# Altium schematic sheet EOG_FRONT_END.SchDoc
size A4; SheetNumber: 1; SheetTotal: 4
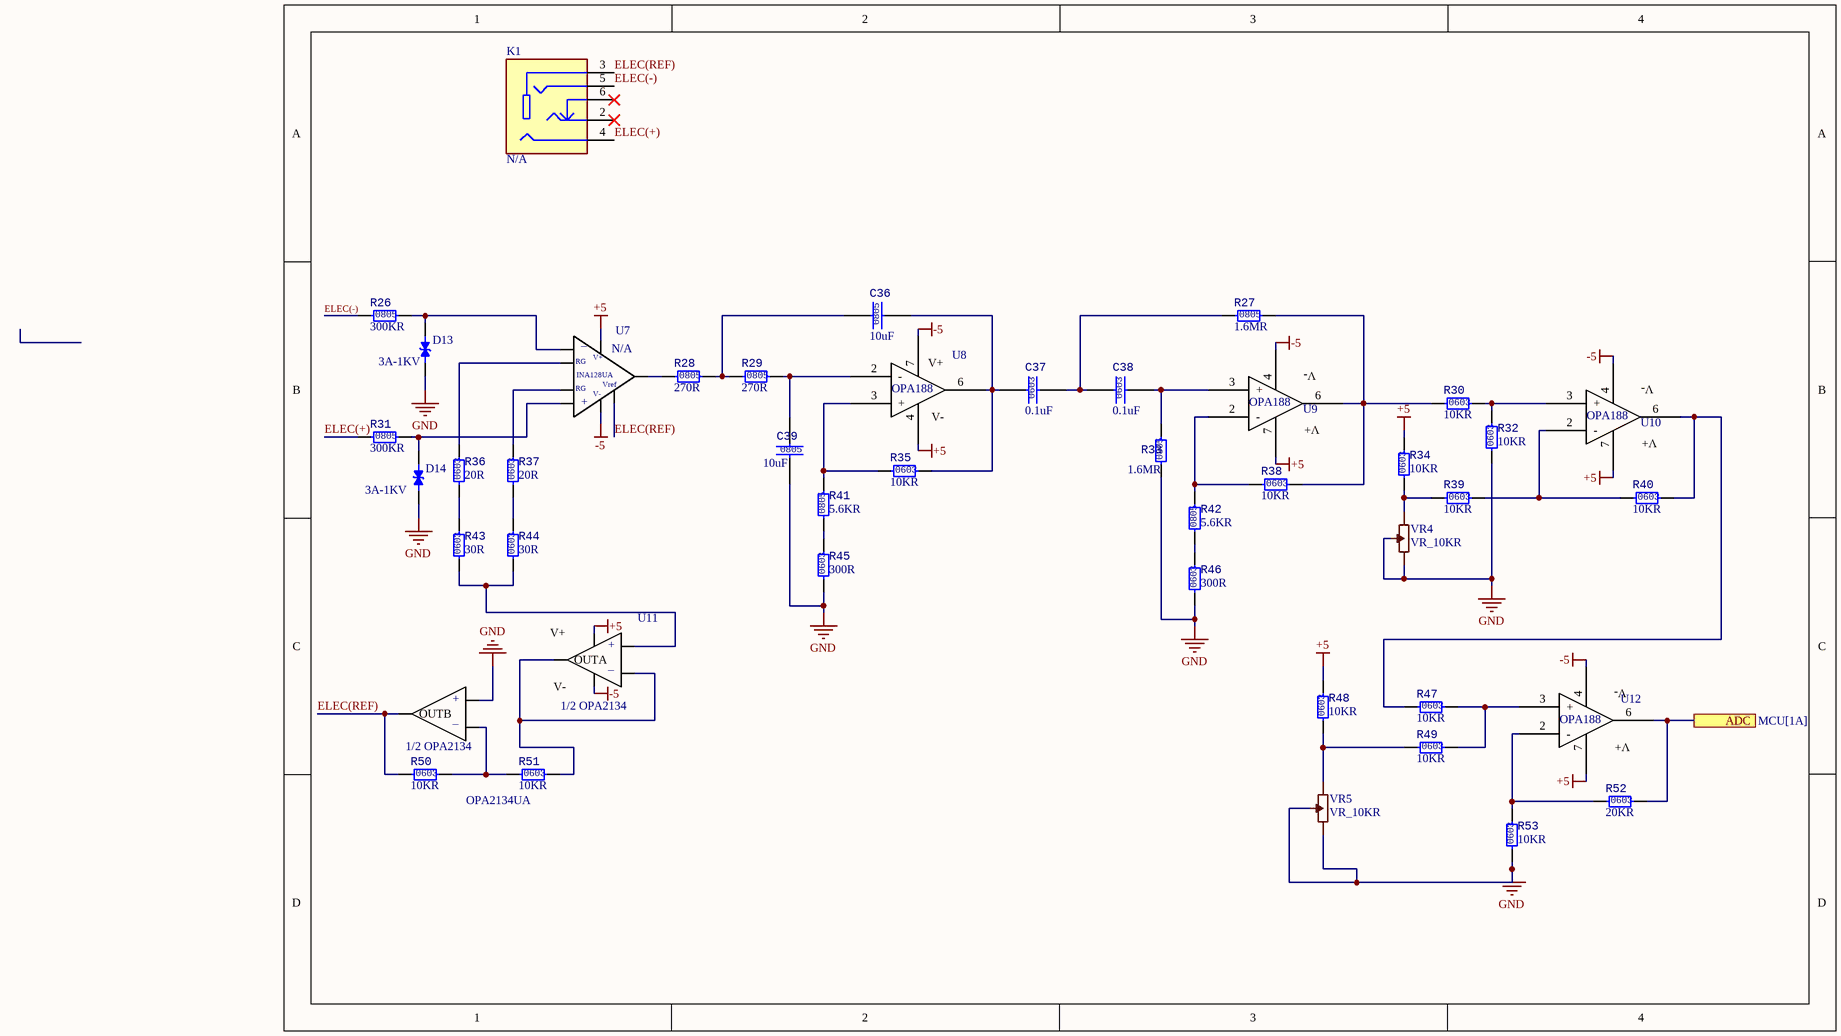
[diagram p0: EOG_FRONT_END.SchDoc]

## Parts
C36  Size: 0805  [CAPCER 0603 SMD]  (hidden comment: 10uF)
C37  Size: 0603  [CAPCER 0805 SMD]  (hidden comment: 0.1uF)
C38  Size: 0603  [CAPCER 0805 SMD]  (hidden comment: 0.1uF)
C39  Size: 0805  [CAPCER 0603 SMD]  (hidden comment: 10uF)
D13  value 3A-1KV  [DO-214AC]  (hidden comment: SMAJ5.0)
D14  value 3A-1KV  [DO-214AC]  (hidden comment: SMAJ5.0)
K1  JACK_3.5_5P  [PJ-327A]  (value not drawn)
R26  Size: 0805  [RESC 0805 SMD]  (hidden comment: 300KR)
R27  Size: 0805  [RESC 0805 SMD]  (hidden comment: 1.6MR)
R28  Size: 0805  [RESC 0805 SMD]  (hidden comment: 270R)
R29  Size: 0805  [RESC 0805 SMD]  (hidden comment: 270R)
R30  Size: 0603  [RESC 0603(1608) SMD]  (hidden comment: 10KR)
R31  Size: 0805  [RESC 0805 SMD]  (hidden comment: 300KR)
R32  Size: 0603  [RESC 0603(1608) SMD]  (hidden comment: 10KR)
R33  Size: 0805  [RESC 0805 SMD]  (hidden comment: 1.6MR)
R34  Size: 0603  [RESC 0603(1608) SMD]  (hidden comment: 10KR)
R35  Size: 0603  [RESC 0603(1608) SMD]  (hidden comment: 10KR)
R36  value 20R  Size: 0603  [RESC 0603(1608) SMD]  (hidden comment: 510R)
R37  value 20R  Size: 0603  [RESC 0603(1608) SMD]  (hidden comment: 510R)
R38  Size: 0603  [RESC 0603(1608) SMD]  (hidden comment: 10KR)
R39  Size: 0603  [RESC 0603(1608) SMD]  (hidden comment: 10KR)
R40  Size: 0603  [RESC 0603(1608) SMD]  (hidden comment: 10KR)
R41  Size: 0805  [RESC 0805 SMD]  (hidden comment: 5.6KR)
R42  Size: 0805  [RESC 0805 SMD]  (hidden comment: 5.6KR)
R43  value 30R  Size: 0603  [RESC 0603(1608) SMD]  (hidden comment: 12KR)
R44  value 30R  Size: 0603  [RESC 0603(1608) SMD]  (hidden comment: 12KR)
R45  Size: 0603  [RESC 0603(1608) SMD]  (hidden comment: 300R)
R46  Size: 0603  [RESC 0603(1608) SMD]  (hidden comment: 300R)
R47  Size: 0603  [RESC 0603(1608) SMD]  (hidden comment: 10KR)
R48  Size: 0603  [RESC 0603(1608) SMD]  (hidden comment: 10KR)
R49  Size: 0603  [RESC 0603(1608) SMD]  (hidden comment: 10KR)
R50  Size: 0603  [RESC 0603(1608) SMD]  (hidden comment: 10KR)
R51  Size: 0603  [RESC 0603(1608) SMD]  (hidden comment: 10KR)
R52  value 20KR  Size: 0603  [RESC 0603(1608) SMD]  (hidden comment: 10KR)
R53  Size: 0603  [RESC 0603(1608) SMD]  (hidden comment: 10KR)
U7  INA128UA  [8-SOIC]  (value not drawn)
U8  value OPA188  [8-SOIC-OPA]  (hidden comment: OPA188AID)
U9  value OPA188  [8-SOIC-OPA]  (hidden comment: OPA188AID)
U10  value OPA188  [8-SOIC-OPA]  (hidden comment: OPA188AID)
U11  OPA2134UA  [8-SOIC-OPA]
U12  value OPA188  [8-SOIC-OPA]  (hidden comment: OPA188AID)
VR4  VR_10KR  [EVM3E]
VR5  VR_10KR  [EVM3E]

## Ports
ADC (see MCU[1A])

## Nets
+5: R34.2 R48.2 U7.7 U8.4(GND) U9.7(VCC) U10.7(VCC) U11.8(V+) U12.7(VCC)
-5: U7.4 U8.7(VCC) U9.4(GND) U10.4(GND) U11.4(V-) U12.4(GND)
GND: C39.2 D13.1 D14.1 R32.1 R33.1 R45.1 R46.1 R53.1 U11.5(INB(+)) VR4.1 VR4.2 VR5.1 VR5.2
ADC: R52.2 U12.6(OUT_1) ; port ADC
ELEC(+): K1.4 R31.1
ELEC(-): K1.5 R26.1
ELEC(REF): K1.3 R50.1 U7.5 U11.7(OUTB)
NetC36_1: C36.1 R28.2 R29.1
NetC36_2: C36.2 C37.1 R35.2 U8.6(OUT_1)
NetC37_2: C37.2 C38.1 R27.1
NetC38_2: C38.2 R33.2 U9.3(+)
NetC39_1: C39.1 R29.2 U8.2(-)
NetD13_2: D13.2 R26.2 U7.2
NetD14_2: D14.2 R31.2 U7.3
NetR27_2: R27.2 R30.1 R38.2 U9.6(OUT_1)
NetR28_1: R28.1 U7.6
NetR30_2: R30.2 R32.2 U10.3(+)
NetR34_1: R34.1 R39.1 VR4.3
NetR35_1: R35.1 R41.2 U8.3(+)
NetR36_1: R36.1 R43.2
NetR36_2: R36.2 U7.1
NetR37_1: R37.1 R44.2
NetR37_2: R37.2 U7.8
NetR38_1: R38.1 R42.2 U9.2(-)
NetR39_2: R39.2 R40.1 U10.2(-)
NetR40_2: R40.2 R47.1 U10.6(OUT_1)
NetR41_1: R41.1 R45.2
NetR42_1: R42.1 R46.2
NetR43_1: R43.1 R44.1 U11.2(INA(+))
NetR47_2: R47.2 R49.2 U12.3(+)
NetR48_1: R48.1 R49.1 VR5.3
NetR50_2: R50.2 R51.1 U11.6(INB(-))
NetR51_2: R51.2 U11.1(OUTA) U11.3(INA(-))
NetR52_1: R52.1 R53.2 U12.2(-)

Not connected (* = marked no-connect by the designer): K1 2* 6(3)*

## Notes on the sheet
- (in symbol DB-0014) V-; V+
- (in symbol DB-0015) _; V+; RG; Vref; V-; +
- (in symbol DB-0029) +; _; 1/2 OPA2134

## Library data of the parts
C36 C39 = DB-0018: CAPACITOR SMD 10uF 25V 10% 0805; Design Item ID: DB-0018; Value: 10uF; Type: CAPACITOR; Power Rate: N/A; Tolerance: 10%; Footprint Type: SMD; Supplier: THEGIOIIC; Supplier Part Number: Tụ Gốm 0805 10uF 25V; Supplier Link: https://www.thegioiic.com/tu-gom-0805-10uf-25v
C37 C38 = DB-0017: CAPACITOR SMD 0.1uF 50V 10% 0603; Design Item ID: DB-0017; Value: 0.1uF; Type: CAPACITOR; Power Rate: N/A; Tolerance: 10%; Footprint Type: SMD; Supplier: THEGIOIIC; Supplier Part Number: Tụ Gốm 0603 100nF (0.1uF) 25V; Supplier Link: https://www.thegioiic.com/tu-gom-0603-100nf-0-1uf-25v
D13 D14 = DB-0021: TVS DIODE 5VWM 9.2VC SMA; Design Item ID: DB-0021; Type: DIODE; Power Rate: N/A; Tolerance: N/A; Footprint Type: SMD; Size: SMA; Supplier: DIGIKEY; Supplier Part Number: TVS DIODE 5VWM 9.2VC SMA; Supplier Link: https://www.digikey.com/en/products/detail/diodes-incorporated/smaj5-0a-13/278666
K1 = DB-0060: PJ-327A Cổng Audio 3.5mm 3 Cực 5 Chân Dán SMD; Value: N/A; Design Item ID: DB-0060; Type: N/A; Power Rate: N/A; Tolerance: N/A; Footprint Type: SMD; Size: PJ-327A; Supplier: THEGIOIIC; Supplier Part Number: PJ-327A Cổng Audio 3.5mm 3 Cực 5 Chân Dán SMD; Supplier Link: https://www.thegioiic.com/pj-327a-cong-audio-3-5mm-3-cuc-5-chan-dan-smd
R26 R31 = DB-0016: RESISTOR SMD 300KR OHM 5% 125mW 0805; Power Rate: 125mW; Design Item ID: DB-0016; Value: 300KR; Type: RESISTOR; Tolerance: 5%; Footprint Type: SMD; Supplier: THEGIOIIC; Supplier Part Number: Điện Trở 300 KOhm 0805 5%; Supplier Link: https://www.thegioiic.com/dien-tro-300-kohm-0805-5-
R27 R33 = DB-0025: RESISTOR SMD 1.6MR OHM 5% 125mW 0805; Power Rate: 125mW; Design Item ID: DB-0025; Value: 1.6MR; Type: RESISTOR; Tolerance: 5%; Footprint Type: SMD; Supplier: THEGIOIIC; Supplier Part Number: Điện Trở 1.6 KOhm 0805 5%; Supplier Link: https://www.thegioiic.com/dien-tro-1-6-kohm-0805-5-
R28 R29 = DB-0022: RESISTOR SMD 270R OHM 5% 125mW 0805; Power Rate: 125mW; Design Item ID: DB-0022; Value: 270R; Type: RESISTOR; Tolerance: 5%; Footprint Type: SMD; Supplier: THEGIOIIC; Supplier Part Number: Điện Trở 270 Ohm 0805 5%; Supplier Link: https://www.thegioiic.com/dien-tro-270-ohm-0805-5-
R30 R32 R34 R35 R38-R40 R47-R53 = DB-0003: RESISTOR SMD 10KR OHM 1% 100mW 0603; Power Rate: 100mW; Design Item ID: DB-0003; Type: RESISTOR; Tolerance: 1%; Footprint Type: SMD; Supplier: THEGIOIIC; Supplier Part Number: Điện Trở 10 KOhm 0603 1%; Supplier Link: https://www.thegioiic.com/dien-tro-10-kohm-0603-1-
  R30 R32 R34 R35 R38-R40 R47-R51 R53: Value: 10KR
R36 R37 = DB-0028: RESISTOR SMD 510R OHM 1% 100mW 0603; Power Rate: 100mW; Design Item ID: DB-0028; Type: RESISTOR; Tolerance: 1%; Footprint Type: SMD; Supplier: THEGIOIIC; Supplier Part Number: Điện Trở 510 Ohm 0603 1%; Supplier Link: https://www.thegioiic.com/dien-tro-510-ohm-0603-1-
R41 R42 = DB-0023: RESISTOR SMD 5.6KR OHM 1% 125mW 0805; Power Rate: 125mW; Design Item ID: DB-0023; Value: 5.6KR; Type: RESISTOR; Tolerance: 1%; Footprint Type: SMD; Supplier: THEGIOIIC; Supplier Part Number: Điện Trở 5.6 KOhm 0805 1%; Supplier Link: https://www.thegioiic.com/dien-tro-5-6-kohm-0805-1-
R43 R44 = DB-0027: RESISTOR SMD 12KR OHM 1% 100mW 0603; Power Rate: 100mW; Design Item ID: DB-0027; Type: RESISTOR; Tolerance: 1%; Footprint Type: SMD; Supplier: THEGIOIIC; Supplier Part Number: Điện Trở 12 KOhm 0603 1%; Supplier Link: https://www.thegioiic.com/dien-tro-12-kohm-0603-1-
R45 R46 = DB-0024: RESISTOR SMD 300R OHM 1% 125mW 0603; Power Rate: 125mW; Design Item ID: DB-0024; Value: 300R; Type: RESISTOR; Tolerance: 1%; Footprint Type: SMD; Supplier: THEGIOIIC; Supplier Part Number: Điện Trở 300 Ohm 0603 1%; Supplier Link: https://www.thegioiic.com/dien-tro-300-ohm-0603-1-
U7 = DB-0015: Instrumentation Amplifier 1 Circuit 8-SOIC; Value: N/A; Design Item ID: DB-0015; Type: IC; Power Rate: N/A; Tolerance: N/A; Footprint Type: SMD; Size: 8-SOIC; Supplier: DIGIKEY; Supplier Part Number: INA128UA; Supplier Link: https://www.digikey.com/en/products/detail/texas-instruments/INA128UA/300997
U8-U10 U12 = DB-0014: Zero-Drift Amplifier 1 Circuit Rail-to-Rail 8-SOIC; Design Item ID: DB-0014; Type: IC; Power Rate: N/A; Tolerance: N/A; Footprint Type: SMD; Size: 8-SOIC; Supplier: DIGIKEY; Supplier Part Number: OPA188AID; Supplier Link: https://www.digikey.com/en/products/detail/texas-instruments/OPA188AID/4146941
U11 = DB-0029: IC AUDIO 2 CIRCUIT 8SOIC; Value: OPA2134UA; Design Item ID: DB-0029; Type: IC; Power Rate: N/A; Tolerance: N/A; Footprint Type: SMD; Size: 8-SOIC; Supplier: DIGIKEY; Supplier Part Number: IC AUDIO 2 CIRCUIT 8SOIC; Supplier Link: https://www.digikey.com/en/products/detail/texas-instruments/OPA2134UA
VR4 VR5 = DB-0026: EVM3E-103 Biến Trở 10 KOhm Nút Áo SMD 0.15W; Tolerance: 20%; Value: VR_10KR; Design Item ID: DB-0026; Type: VRES; Power Rate: 0.15W; Footprint Type: SMD; Size: EVM3E; Supplier: THEGIOIIC; Supplier Part Number: EVM3E-103 Biến Trở 10 KOhm Nút Áo SMD 0.15W; Supplier Link: https://www.thegioiic.com/evm3e-103-bien-tro-10-kohm-nut-ao-smd-0-15w